# EAGLE schematic JBCproject (EAGLE 6.5.0)
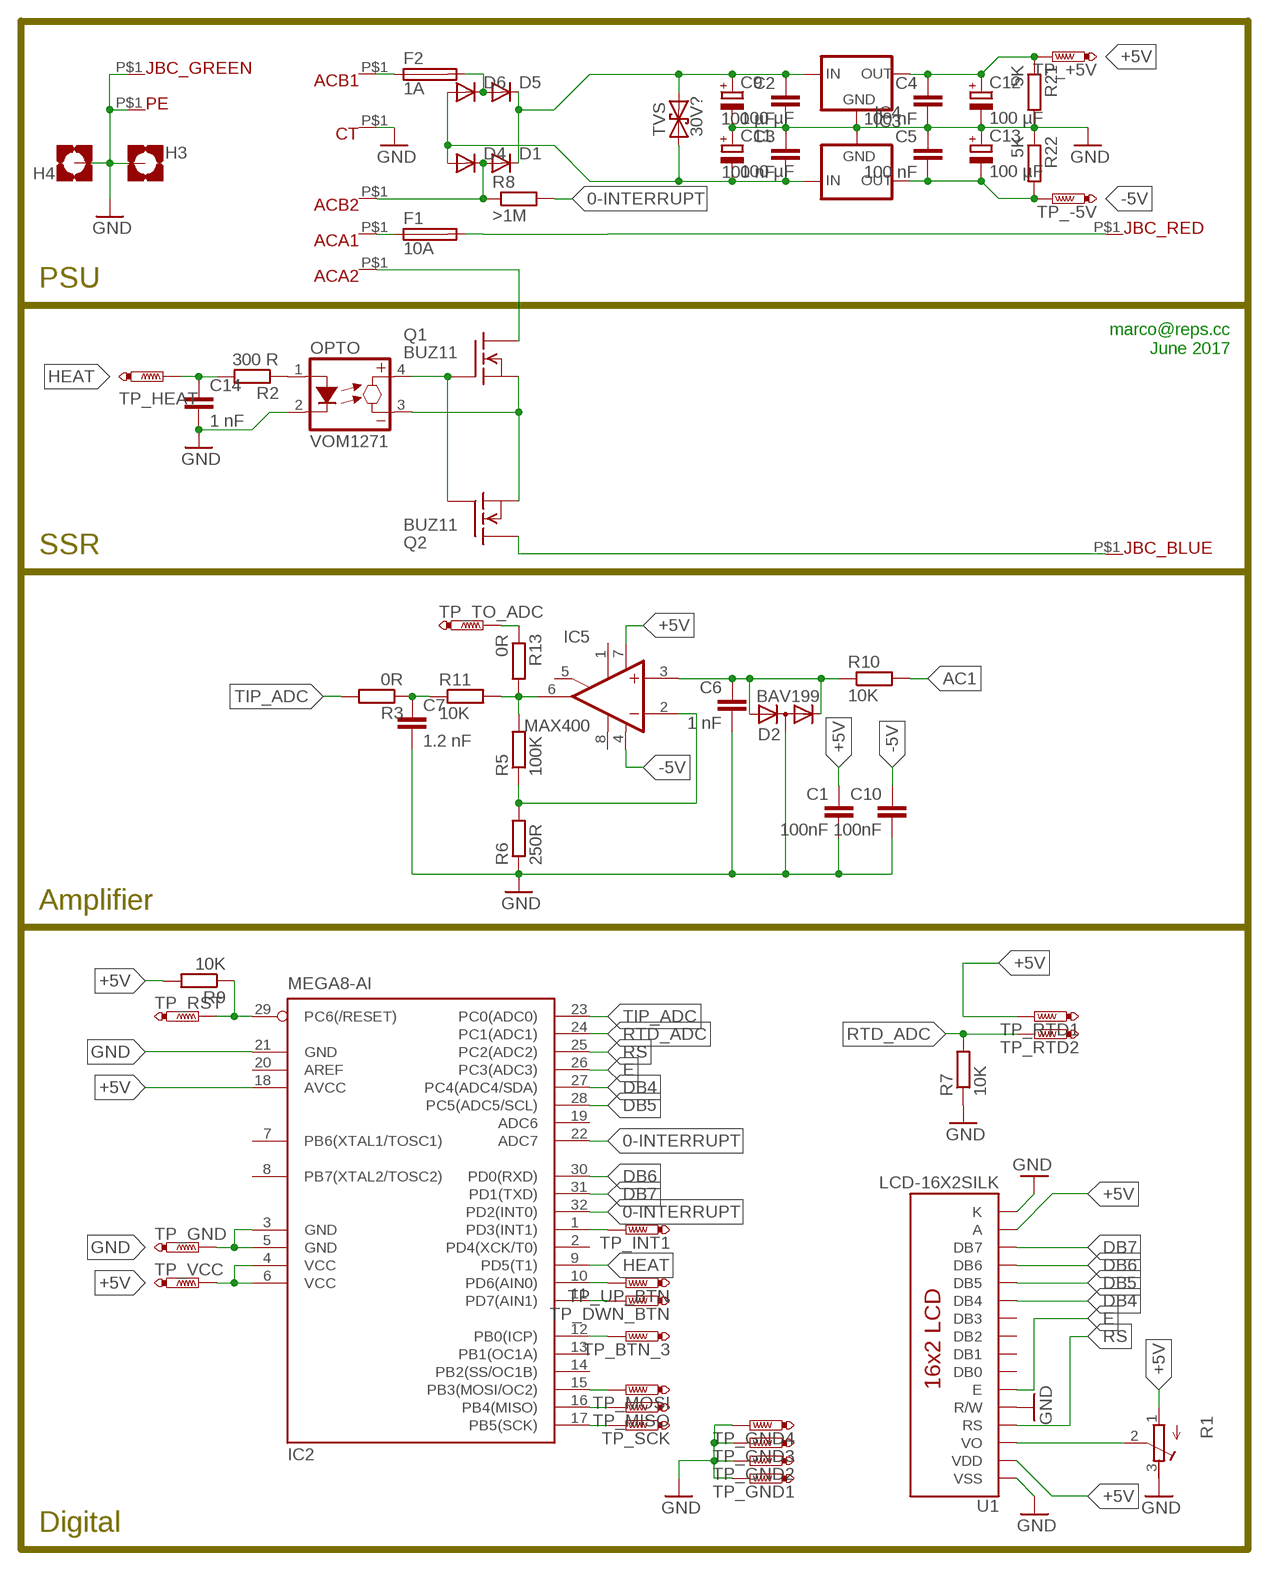
[diagram p0: schematic, sheet 1]

## Parts
ACA1  1MMPIN  [1MMPIN]
ACA2  1MMPIN  [1MMPIN]
ACB1  1MMPIN  [1MMPIN]
ACB2  1MMPIN  [1MMPIN]
C1  100nF  C-EUC1206  [C1206]
C2  100 µF  C-EUC1206  [C1206]
C3  100 nF  C-EUC1206  [C1206]
C4  100 nF  C-EUC1206  [C1206]
C5  100 nF  C-EUC1206  [C1206]
C6  1 nF  C-EUC1206  [C1206]
C7  1.2 nF  C-EUC1206  [C1206]
C9  100 µF  CPOL-EU175TMP-0810  [175TMP-0810]
C10  100nF  C-EUC1206  [C1206]
C11  100 µF  CPOL-EU175TMP-0810  [175TMP-0810]
C12  100 µF  CPOL-EU175TMP-0810  [175TMP-0810]
C13  100 µF  CPOL-EU175TMP-0810  [175TMP-0810]
C14  1 nF  C-EUC1206  [C1206]
CT  1MMPIN  [1MMPIN]
D1  ES2D  [SMB]
D2  BAV199  [SOT23]
D4  ES2D  [SMB]
D5  ES2D  [SMB]
D6  ES2D  [SMB]
F1  10A  PICOFUSE  [PICOFUSE]
F2  1A  PICOFUSE  [PICOFUSE]
H3  MOUNT-PAD-SQUARE3.0  [3,0-PAD-SQUARE]
H4  MOUNT-PAD-SQUARE3.0  [3,0-PAD-SQUARE]
IC2  MEGA8-AI  [TQFP32-08]
IC3  78XXS  [78XXS]
IC4  79XXS  [79XXS]
IC5  MAX400  MAX400MJA  [DIL08]
JBC_BLUE  1MMPIN  [1MMPIN]
JBC_GREEN  1MMPIN  [1MMPIN]
JBC_RED  1MMPIN  [1MMPIN]
OPTO  VOM1271  [SOP-4]
PE  1MMPIN  [1MMPIN]
Q1  BUZ11  [TO220]
Q2  BUZ11  [TO220]
R1  R-TRIMM4G/J  [RTRIM4G/J]
R2  300 R  R-EU_R1206  [R1206]
R3  0R  R-EU_R1206  [R1206]
R5  100K  R-EU_R1206  [R1206]
R6  250R  R-EU_R1206  [R1206]
R7  10K  R-EU_R1206  [R1206]
R8  >1M  R-EU_R1206  [R1206]
R9  10K  R-EU_R1206  [R1206]
R10  10K  R-EU_R1206  [R1206]
R11  10K  R-EU_R1206  [R1206]
R13  0R  R-EU_R1206  [R1206]
R21  5K  R-EU_R1206  [R1206]
R22  5K  R-EU_R1206  [R1206]
TP_+5V  PTR1TP20R  [TP20R]
TP_-5V  PTR1TP20R  [TP20R]
TP_BTN_3  PTR1TP20R  [TP20R]
TP_DWN_BTN  PTR1TP20R  [TP20R]
TP_GND  PTR1TP20R  [TP20R]
TP_GND1  PTR1TP20R  [TP20R]
TP_GND2  PTR1TP20R  [TP20R]
TP_GND3  PTR1TP20R  [TP20R]
TP_GND4  PTR1TP20R  [TP20R]
TP_HEAT  PTR1TP20R  [TP20R]
TP_INT1  PTR1TP20R  [TP20R]
TP_MISO  PTR1TP20R  [TP20R]
TP_MOSI  PTR1TP20R  [TP20R]
TP_RST  PTR1TP20R  [TP20R]
TP_RTD1  PTR1TP20R  [TP20R]
TP_RTD2  PTR1TP20R  [TP20R]
TP_SCK  PTR1TP20R  [TP20R]
TP_TO_ADC  PTR1TP20R  [TP20R]
TP_UP_BTN  PTR1TP20R  [TP20R]
TP_VCC  PTR1TP20R  [TP20R]
TVS  30V?  TVS  [SMA-DIODE]
U1  LCD-16X2SILK  [LCD-16X2]

## Nets
0-INTERRUPT: IC2.22(ADC7) IC2.32(PD2(INT0)) R8.2
+5V: C1.1 C4.1 C12.+ IC2.4(VCC) IC2.6(VCC) IC2.18(AVCC) IC3.OUT IC5.7(V+) R1.1(A) R9.2 R21.1 TP_+5V.TP TP_RTD1.TP TP_VCC.TP U1.2(VDD) U1.15(A)
-5V: C5.2 C10.1 C13.- IC4.OUT IC5.4(V-) R22.2 TP_-5V.TP
AC1: F1.2 JBC_RED.P$1 R10.2
AC2: ACA2.P$1 Q1.2(D)
ACB1: D5.A D6.C F2.2
DB4: IC2.27(PC4(ADC4/SDA)) U1.11(DB4)
DB5: IC2.28(PC5(ADC5/SCL)) U1.12(DB5)
DB6: IC2.30(PD0(RXD)) U1.13(DB6)
DB7: IC2.31(PD1(TXD)) U1.14(DB7)
E: IC2.26(PC3(ADC3)) U1.6(E)
GND: C1.2 C2.2 C3.1 C4.2 C5.1 C6.2 C7.2 C9.- C10.2 C11.+ C12.- C13.+ C14.2 CT.P$1 D2.3(AC) H3.B3,0(MOUNT) H4.B3,0(MOUNT) IC2.3(GND) IC2.5(GND) IC2.21(GND) IC3.GND IC4.GND JBC_GREEN.P$1 OPTO.2 PE.P$1 R1.3(E) R6.1 R7.1 R21.2 R22.1 TP_GND1.TP TP_GND2.TP TP_GND3.TP TP_GND4.TP TP_GND.TP U1.1(VSS) U1.5(R/W) U1.16(K)
HEAT: C14.1 IC2.9(PD5(T1)) R2.2 TP_HEAT.TP
N$1: R1.2(S) U1.3(VO)
N$2: OPTO.1 R2.1
N$3: OPTO.4 Q1.1(G) Q2.1(G)
N$4: OPTO.3 Q1.3(S) Q2.3(S)
N$5: ACA1.P$1 F1.1
N$6: ACB1.P$1 F2.1
N$7: C3.2 C11.- D4.A D6.A IC4.IN TVS.A
N$8: C2.1 C9.+ D1.C D5.C IC3.IN TVS.C
N$9: IC2.15(PB3(MOSI/OC2)) TP_MOSI.TP
N$10: IC2.17(PB5(SCK)) TP_SCK.TP
N$11: IC2.10(PD6(AIN0)) TP_UP_BTN.TP
N$12: JBC_BLUE.P$1 Q2.2(D)
N$13: IC2.11(PD7(AIN1)) TP_DWN_BTN.TP
N$14: IC2.1(PD3(INT1)) TP_INT1.TP
N$15: IC2.16(PB4(MISO)) TP_MISO.TP
N$16: ACB2.P$1 D1.A D4.C R8.1
N$17: IC5.2(-IN) R5.1 R6.2
N$19: IC2.29(PC6(/RESET)) R9.1 TP_RST.TP
N$20: C7.1 R3.1 R11.1
N$23: IC2.12(PB0(ICP)) TP_BTN_3.TP
OPAMP: C6.1 D2.1(A) D2.2(C) IC5.3(+IN) R10.1
OPAMPOUT: IC5.6(OUT) R5.2 R11.2 R13.1 R13.2 TP_TO_ADC.TP
RS: IC2.25(PC2(ADC2)) U1.4(RS)
RTD_ADC: IC2.24(PC1(ADC1)) R7.2 TP_RTD2.TP
TIP_ADC: IC2.23(PC0(ADC0)) R3.2
Unconnected: IC2.2(PD4(XCK/T0)) IC2.7(PB6(XTAL1/TOSC1)) IC2.8(PB7(XTAL2/TOSC2)) IC2.13(PB1(OC1A)) IC2.14(PB2(SS/OC1B)) IC2.19(ADC6) IC2.20(AREF) IC5.1(VOS) IC5.5(NC) IC5.8(VOS) U1.7(DB0) U1.8(DB1) U1.9(DB2) U1.10(DB3)

## Notes on the sheet
- PSU
- marco@reps.cc
  June 2017
- SSR
- Amplifier
- Digital

## Library data of the parts
ACA1 ACA2 ACB1 ACB2 CT JBC_BLUE JBC_GREEN JBC_RED PE = 1mmPin:1MMPIN
C1-C7 C10 C14 = rcl:C-EU: CAPACITOR, European symbol
C9 C11-C13 = rcl:CPOL-EU: POLARIZED CAPACITOR, European symbol
D1 D4-D6 = diode:ES2D: DIODE super fast rectifier, 2 A
D2 = diode:BAV199: DIODE low-leakage double diode
F1 F2 = fuse:PICOFUSE: PICOFUSE 19275, Wickmann; OC_FARNELL: unknown; OC_NEWARK: unknown
H3 H4 = holes:MOUNT-PAD-SQUARE: MOUNTING PAD, square
IC2 = atmel:MEGA8: MICROCONTROLLER 8 Kbytes FLASH, 1 kbytes SRAM, 512 bytes EEPROM, USART, 6-channel 10 bit ADC, 2-channel 8 bit ADC Pin compatible with Atmega48, ATMega88, ATMega168 Source: avr.lbr; MPN: ATMEGA8-16AU; OC_FARNELL: 9171371; OC_NEWARK: 73M8863
IC3 = v-reg:78XXS: VOLTAGE REGULATOR
IC4 = v-reg:79XXS: VOLTAGE REGULATOR
IC5 = maxim:MAX400MJA: OP AMP; OC_FARNELL: unknown; OC_NEWARK: unknown
OPTO = optocoupler:VOM1271
Q1 Q2 = transistor-fet:BUZ11: N-Channel Enhancement MOSFET 50V; 30A; 0,040Ohm
R1 = rcl:R-TRIMM: Trimm resistor
R2 R3 R5-R11 R13 R21 R22 = rcl:R-EU_: RESISTOR, European symbol
TP_+5V TP_-5V TP_BTN_3 TP_DWN_BTN TP_GND TP_GND1-TP_GND4 TP_HEAT TP_INT1 TP_MISO TP_MOSI TP_RST TP_RTD1 TP_RTD2 TP_SCK TP_TO_ADC TP_UP_BTN TP_VCC = testpad:PTR1: TEST PIN
TVS = SparkFun-DiscreteSemi:TVS: Transient voltage suppressor- prevents ESD on inputs. Ignore package description- MBRA140 is NOT this type of part!!!
U1 = SparkFun-Displays:LCD-16X2: Standard text-only 16x2 parallel input LCD